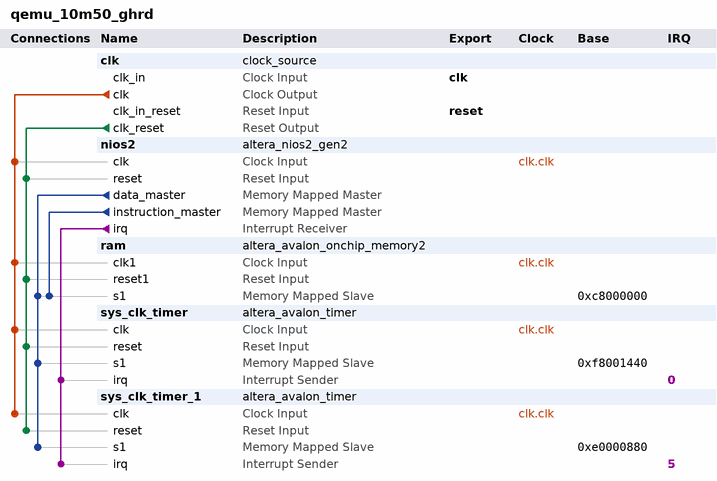
[diagram p0: system contents]
# Platform Designer (Qsys) system qemu_10m50_ghrd, Cyclone V 5CEBA2F17A7
# Parameters at their usual value, and those the tool derives, are not listed.
package require -exact qsys 17.1
create_system qemu_10m50_ghrd
set_project_property DEVICE_FAMILY {Cyclone V}
set_project_property DEVICE 5CEBA2F17A7

add_instance clk clock_source 17.1
set_instance_parameter_value clk clockFrequency 75000000

add_instance nios2 altera_nios2_gen2 17.1
set_instance_parameter_value nios2 dcache_size 2048
set_instance_parameter_value nios2 debug_enabled false
set_instance_parameter_value nios2 exceptionOffset 288
set_instance_parameter_value nios2 exceptionSlave ram.s1
set_instance_parameter_value nios2 icache_size 4096
set_instance_parameter_value nios2 impl Fast
set_instance_parameter_value nios2 resetSlave ram.s1
set_instance_parameter_value nios2 setting_support31bitdcachebypass false

add_instance ram altera_avalon_onchip_memory2 17.1
set_instance_parameter_value ram dataWidth 32
set_instance_parameter_value ram dualPort false
set_instance_parameter_value ram initMemContent true
set_instance_parameter_value ram initializationFileName onchip_mem.hex
set_instance_parameter_value ram memorySize 16777216

add_instance sys_clk_timer altera_avalon_timer 17.1
set_instance_parameter_value sys_clk_timer period 1
set_instance_parameter_value sys_clk_timer periodUnits MSEC

add_instance sys_clk_timer_1 altera_avalon_timer 17.1
set_instance_parameter_value sys_clk_timer_1 period 1
set_instance_parameter_value sys_clk_timer_1 periodUnits MSEC

# connections
add_connection clk.clk nios2.clk clock
add_connection clk.clk ram.clk1 clock
add_connection clk.clk sys_clk_timer.clk clock
add_connection clk.clk sys_clk_timer_1.clk clock
add_connection clk.clk_reset nios2.reset reset
add_connection clk.clk_reset ram.reset1 reset
add_connection clk.clk_reset sys_clk_timer.reset reset
add_connection clk.clk_reset sys_clk_timer_1.reset reset
add_connection nios2.data_master ram.s1 avalon
set_connection_parameter_value nios2.data_master/ram.s1 baseAddress 0xc8000000
add_connection nios2.data_master sys_clk_timer.s1 avalon
set_connection_parameter_value nios2.data_master/sys_clk_timer.s1 baseAddress 0xf8001440
add_connection nios2.data_master sys_clk_timer_1.s1 avalon
set_connection_parameter_value nios2.data_master/sys_clk_timer_1.s1 baseAddress 0xe0000880
add_connection nios2.instruction_master ram.s1 avalon
set_connection_parameter_value nios2.instruction_master/ram.s1 baseAddress 0xc8000000
add_connection nios2.irq sys_clk_timer.irq interrupt
set_connection_parameter_value nios2.irq/sys_clk_timer.irq irqNumber 0
add_connection nios2.irq sys_clk_timer_1.irq interrupt
set_connection_parameter_value nios2.irq/sys_clk_timer_1.irq irqNumber 5

# exported interfaces
add_interface clk clock sink
set_interface_property clk EXPORT_OF clk.clk_in
add_interface reset reset sink
set_interface_property reset EXPORT_OF clk.clk_in_reset

set_interconnect_requirement {$system} qsys_mm.clockCrossingAdapter HANDSHAKE
set_interconnect_requirement {$system} qsys_mm.enableEccProtection FALSE
set_interconnect_requirement {$system} qsys_mm.insertDefaultSlave FALSE
set_interconnect_requirement {$system} qsys_mm.maxAdditionalLatency 1

save_system qemu_10m50_ghrd.qsys
